# EAGLE design Puzzle_Light_Sensor_v1.2 (EAGLE 6.6.0)
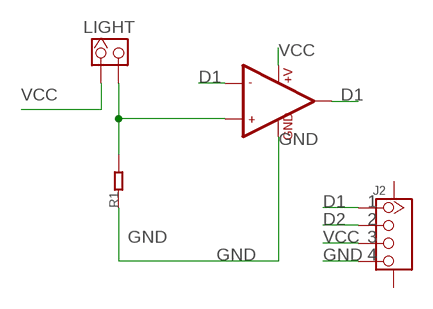
[diagram p0: schematic, sheet 1]

## Parts
J2  TWIG-4P-2.0-SMD-FEMALE-REINFORCE'DD'  [4P-SMD-2.0]
LIGHT  HEADER_1X2_2.54  [CK_1*2]
R1  R0603  [0603]
U1  LMV358  [SO08]

## Nets
D1: J2.1 U1.1(OUT1) U1.2(-IN1)
D2: J2.2
GND: J2.4 R1.1 U1.4(GND)
N$3: LIGHT.2 R1.2 U1.3(+IN1)
VCC: J2.3 LIGHT.1 U1.8(+V)
Unconnected: J2.SS1 J2.SS2 U1.5(+IN2) U1.6(-IN2) U1.7(OUT2)

## Notes on the sheet
- 1
- 2
- 3
- 4

## Library data of the parts
J2 = Connector4pin-dip:TWIG-4P-2.0-SMD-FEMALE-REINFORCE
LIGHT = CONNECTER:HEADER_1X2
R1 = CPT_SMD:R0603
U1 = ICs_v54:LMV358

## Board
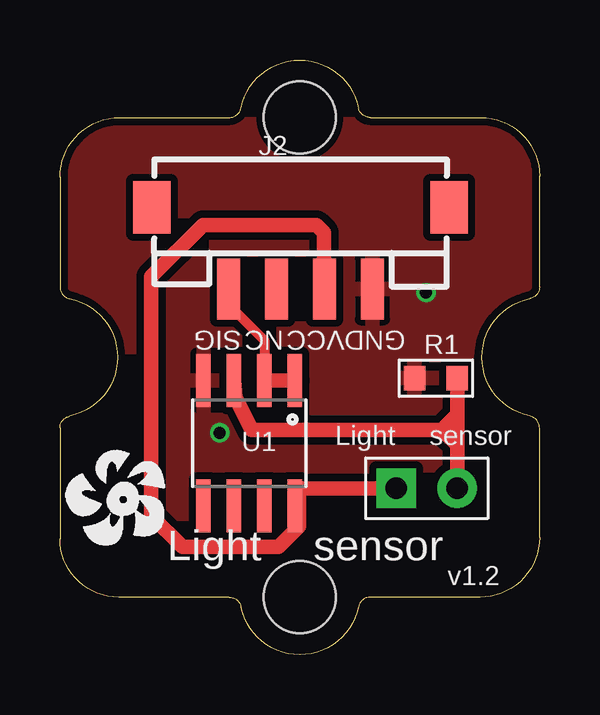
[diagram p1: board, top side]
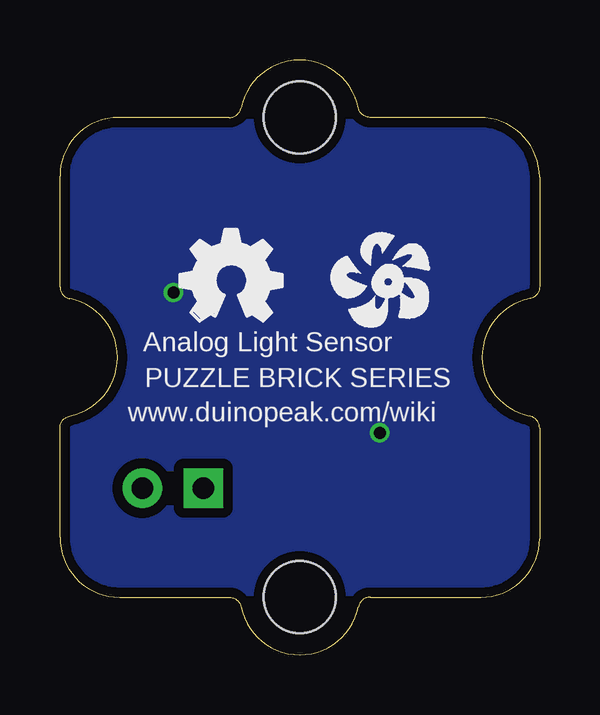
[diagram p2: board, bottom side, seen from below]

Size 20 x 24.8 mm. Coordinates in mm from the lower left corner, seen from the top.
Copper layers (1*16): Top 0.035mm / dielectric 1.5mm / Bottom 0.035mm
Design rules "default": minimum track width 6mil, minimum drill 12mil, track to track 6mil, track to pad 6mil, pad to pad 6mil, via to via 6mil, smd to smd 0mil, copper to edge 10mil, drill to drill 10mil, minimum pad ring 10mil, minimum via ring 6mil, stop-mask expansion 2mil, vias tented up to drill 100mil, thermal gap 10mil

### Footprints (pad centres in the part's own frame; a part is rotated, then mirrored left to right if it is on the bottom)
4P-SMD-2.0 = smd 0.965 x 2.54: 1 -3,0; 2 -1,0; 3 1,0; 4 3,0 | smd 1.55 x 2.184: SS1 -6.2,3.4; SS2 6.2,3.4
CK_1*2 = drill 0.889 pad 1.651 square: 1 0,1.27 | drill 0.889 pad 1.651: 2 0,-1.27
0603 = smd 0.889 x 1.016: 1 -0.889,0; 2 0.889,0
SO08 = smd 0.61 x 2.21: 1 -1.905,-2.616; 2 -0.635,-2.616; 3 0.635,-2.616; 4 1.905,-2.616; 5 1.905,2.616; 6 0.635,2.616; 7 -0.635,2.616; 8 -1.905,2.616
DZJM-B20-1P = hole 3: 0,10; 0,-10

### Placement (x,y rotation side)
J2  10.03,15.26 0 top
LIGHT  15.3,6.95 90 top
R1  15.68,11.53 0 top
U1  7.89,8.83 180 top
U$2  [OPHW-LOGO-FILL-150]  14.98,13.92 0 bottom
U$3  [DZJM-B20-1P]  10,12.4 0 top
U$4  [DUINOFUN-LOGO-PCB-0.55]  0.19,4.53 0 top
U$6  [DUINOFUN-LOGO-PCB-0.55]  8.76,13.61 0 bottom

### Tracks (layer width: path | path; a pad name or v marks a point on that pad's centre or on a via)
D1
  Top 0.406: J2.1 7.03,14.61 8.53,13.11 U1.2
  Top 0.61: U1.2 U1.1
GND  (via drill 0.5)
  other vias: 6.67,9.26 15.27,15.1
  pour Top (isolate 0.305): 22,-0.78 -2.51,-0.78 -2.51,25.51 22,25.51
  pour Bottom (isolate 0.406): 21.87,-0.52 -2.26,-0.52 -2.26,25.51 21.87,25.51
N$3
  Top 0.406: 16.67,10.27 15.78,9.38 16.67,8.5
  Top 0.61: 16.57,9.51 LIGHT.2 | 16.57,9.51 R1.2 | 16.57,9.51 16.44,9.38 15.78,9.38 8,9.38 7.32,10.73 U1.3
VCC
  Top 0.61: 9.96,6.95 LIGHT.1 | U1.8 9.96,6.95 | 9.96,6.95 9.96,5.35 9.11,4.5 5.11,4.5 3.81,5.8 3.81,15.77 5.97,17.93 10.7,17.93 11.02,17.61 11.02,15.78 J2.3

### Text on the board
tPlace: SIG | NC | VCC | GND | Light | sensor | Light | sensor | v1.2
bPlace: Analog Light Sensor | PUZZLE BRICK SERIES | www.duinopeak.com/wiki